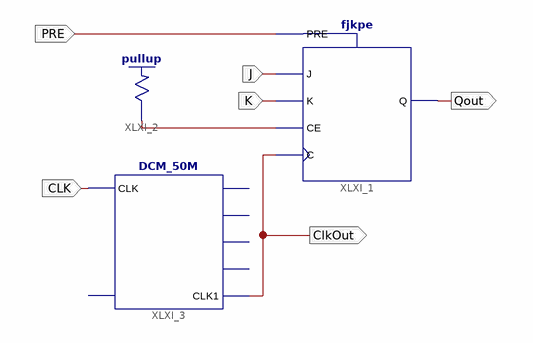
[diagram p0: schematic sheet 1]
// Xilinx ISE schematic lab7exp10pt2.sch (spartan3e) as structural Verilog: 3 symbols, 6 ports
module lab7exp10pt2 (
  input  CLK,
  input  J,
  input  K,
  input  PRE,
  output Qout,
  output ClkOut
);

  wire XLXN_1;

  fjkpe XLXI_1 (.C(ClkOut), .CE(XLXN_1), .J(J), .K(K), .PRE(PRE), .Q(Qout));
  \pullup  XLXI_2 (.O(XLXN_1));
  DCM_50M XLXI_3 (.CLK(CLK), .CLK1(ClkOut));  // open: RST, CLK1M, CLK10k, CLK1k, CLK100
endmodule
